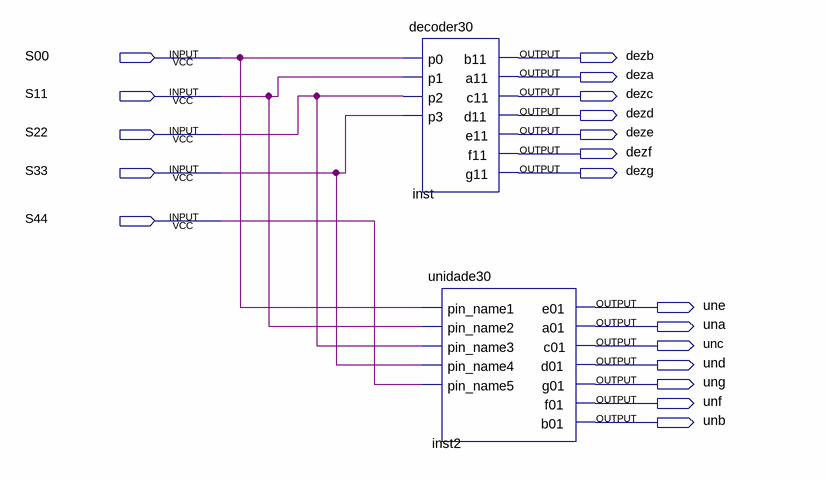
[diagram p0: schematic sheet]
// Quartus schematic decodercompletofinal5bits.bdf as structural Verilog: 2 symbols, 19 pins
module decodercompletofinal5bits (
  input  S00,
  input  S11,
  input  S22,
  input  S33,
  input  S44,
  output dezb,
  output deza,
  output dezc,
  output dezd,
  output deze,
  output dezf,
  output dezg,
  output une,
  output una,
  output unc,
  output und,
  output ung,
  output unf,
  output unb
);

  decoder30 inst (
    .p0(S00), .p1(S11), .p2(S22), .p3(S33), .b11(dezb), .a11(deza), .c11(dezc), .d11(dezd), .e11(deze),
    .f11(dezf), .g11(dezg));
  unidade30 inst2 (
    .pin_name1(S00), .pin_name2(S11), .pin_name3(S22), .pin_name4(S33), .pin_name5(S44), .e01(une),
    .a01(una), .c01(unc), .d01(und), .g01(ung), .f01(unf), .b01(unb));
endmodule
